# EAGLE design Spannungsversorgung (EAGLE 9.3.1)
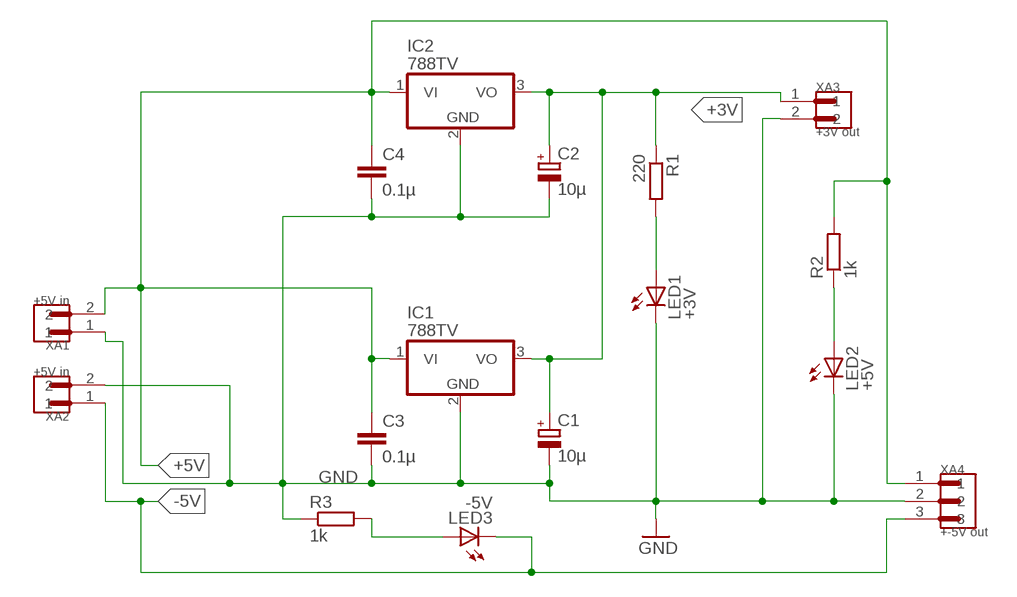
[diagram p0: schematic, sheet 1]

## Parts
C1  10µ  CPOL-EUE2.5-6  [E2,5-6]
C2  10µ  CPOL-EUE2.5-6  [E2,5-6]
C3  0.1µ  C2,5-3  [C2.5-3]
C4  0.1µ  C2,5-3  [C2.5-3]
IC1  788TV  [TO220V]
IC2  788TV  [TO220V]
LED1  +3V  TLLG4400  [LED3MM]
LED2  +5V  TLLG4400  [LED3MM]
LED3  -5V  TLLG4400  [LED3MM]
R1  220  R-EU_0207/7  [0207/7]
R2  1k  R-EU_0207/7  [0207/7]
R3  1k  R-EU_0207/7  [0207/7]
XA1  +5V in  B2P-VH(LF)(SN)  [JST_B2P-VH(LF)(SN)]
XA2  +5V in  B2P-VH(LF)(SN)  [JST_B2P-VH(LF)(SN)]
XA3  +3V out  B2P-VH(LF)(SN)  [JST_B2P-VH(LF)(SN)]
XA4  +-5V out  B3P-VH(LF)(SN)  [JST_B3P-VH(LF)(SN)]

## Nets
+3V: C1.+ C2.+ IC1.3(VO) IC2.3(VO) R1.1 XA3.1
+5V: C3.1 C4.1 IC1.1(VI) IC2.1(VI) R2.2 XA1.2 XA4.1
-5V: LED3.K(C) XA2.1 XA4.3
GND: C1.- C2.- C3.2 C4.2 IC1.2(GND) IC2.2(GND) LED1.K(C) LED2.K(C) R3.1 XA1.1 XA2.2 XA3.2 XA4.2
N$1: LED3.A R3.2
N$2: LED1.A R1.2
N$3: LED2.A R2.1

## Library data of the parts
C1 C2 = rcl:CPOL-EU: POLARIZED CAPACITOR, European symbol
C3 C4 = capacitor-wima:C: CAPACITOR naming: grid - package width
IC1 IC2 = linear:78*: Positive VOLTAGE REGULATOR Source: http://cache.national.com/ds/LM/LM78L05.pdf http://www.fairchildsemi.com/ds/LM/LM7805.pdf
LED1-LED3 = led:TLLG4400: Low Current (2mA) LED 3 mm Tinted Diffused Package color GREEN Source: Data sheet <http://www.farnell.com/datasheets/391098.pdf>; MF: VISHAY SEMICONDUCTOR; OC_FARNELL: 1612435
R1-R3 = resistor:R-EU_: RESISTOR, European symbol
XA1-XA3 = B2P-VH_LF__SN_:B2P-VH(LF)(SN): VH Series 3.96 mm Pitch, Compact, Lock Mechanism also Prevents Misinsertion; AVAILABILITY: Good; DESCRIPTION: VH Series 3.96 mm Pitch, Compact, Lock Mechanism also Prevents Misinsertion; MF: JST; MP: B2P-VH_LF__SN_; PACKAGE: FakePackage u; PRICE: 0.11 USD
XA4 = B3P-VH_LF__SN_:B3P-VH(LF)(SN): VH Series 3 Position 3.96 mm Pitch Through Hole Crimp Locking Header; AVAILABILITY: Good; DESCRIPTION: VH Series 3 Position 3.96 mm Pitch Through Hole Crimp Locking Header; MF: JST; MP: B3P-VH_LF__SN_; PACKAGE: FakePackage u; PRICE: 0.12 USD

## Net classes
0 default: clearance 0.205 mm

## Board
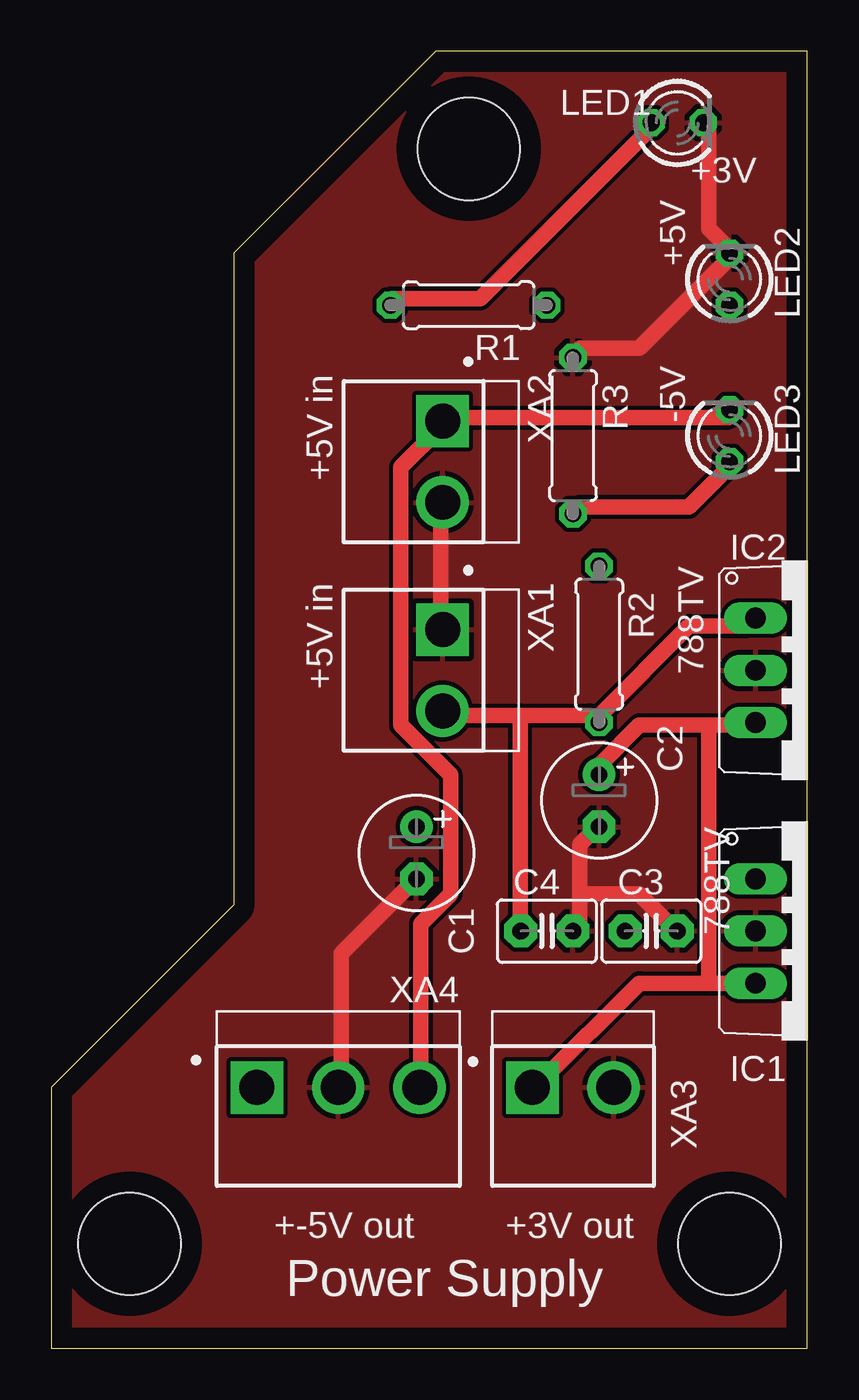
[diagram p1: board, top side]
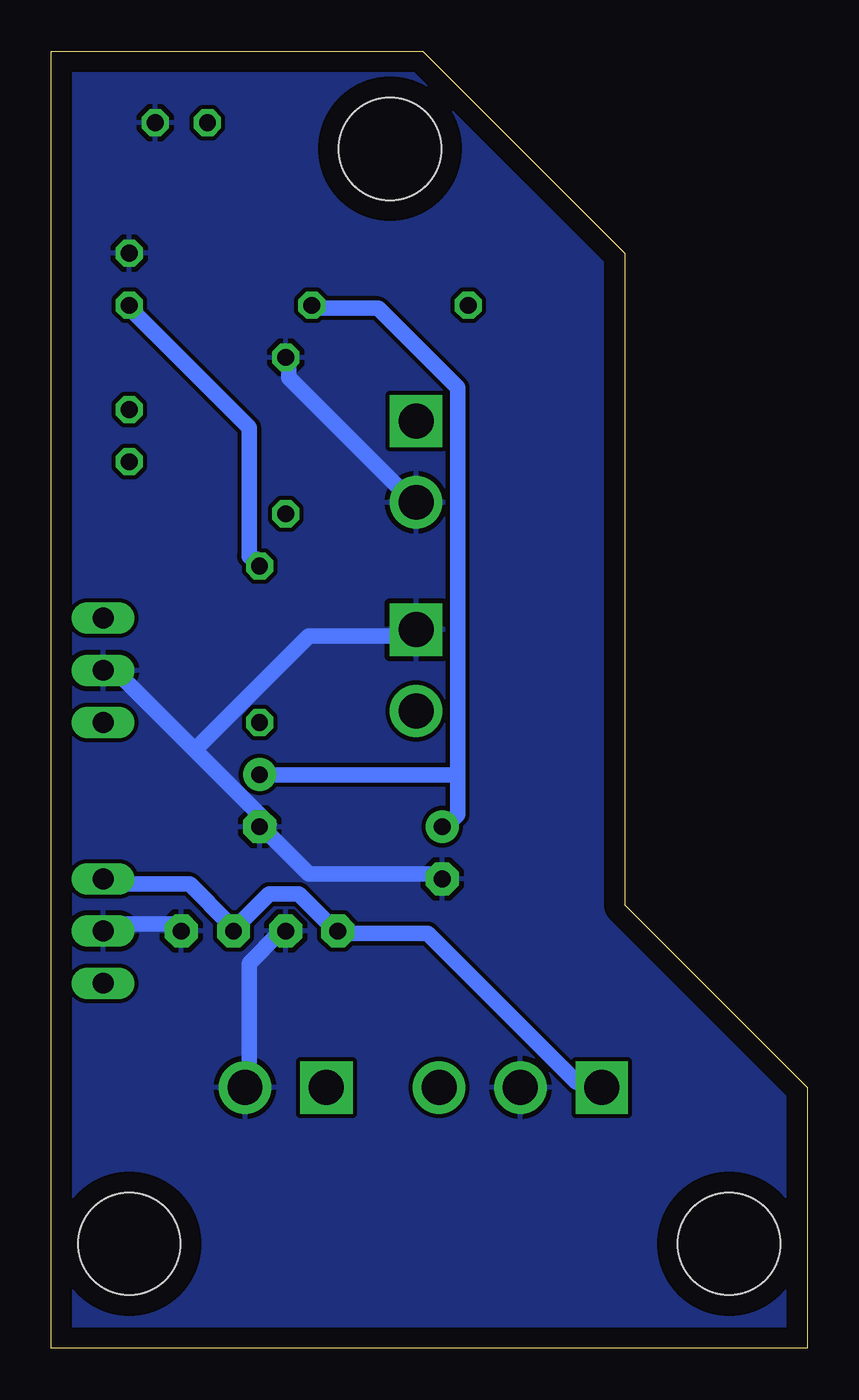
[diagram p2: board, bottom side, seen from below]

Size 36.81 x 63.17 mm. Coordinates in mm from the lower left corner, seen from the top.
Outline: 36.81,0 36.81,63.17 18.72,63.17 8.89,53.34 8.89,21.59 0,12.7 0,0 36.81,0
Copper layers (1*16): Top 0.035mm / dielectric 1.5mm / Bottom 0.035mm
Design rules "default *": minimum track width 30mil, minimum drill 0.35mm, track to track 6mil, track to pad 6mil, pad to pad 6mil, via to via 6mil, smd to smd 6mil, copper to edge 40mil, drill to drill 6mil, minimum pad ring 10mil, minimum via ring 8mil, stop-mask expansion 4mil, vias tented up to drill 0mil, thermal gap 10mil
Holes 4.98 mm at 20.32,58.42 3.81,5.08 33.02,5.08

### Footprints (pad centres in the part's own frame; a part is rotated, then mirrored left to right if it is on the bottom)
E2,5-6 = drill 0.813 pad 1.6: + -1.27,0 | drill 0.813 pad 1.6 octagon: - 1.27,0
C2.5-3 = drill 0.813 pad 1.6 octagon: 1 -1.27,0; 2 1.27,0
TO220V = drill 1.016 long: 1 -2.54,-2.54; 2 0,-2.54; 3 2.54,-2.54
LED3MM = drill 0.813 octagon: A -1.27,0; K 1.27,0
0207/7 = drill 0.813 octagon: 1 -3.81,0; 2 3.81,0
JST_B2P-VH(LF)(SN) = drill 1.7 square: 1 -1.98,0 | drill 1.7: 2 1.98,0
JST_B3P-VH(LF)(SN) = drill 1.7 square: 1 -3.96,0 | drill 1.7: 2 0,0; 3 3.96,0

### Placement (x,y rotation side)
C1  17.78,24.13 270 top
C2  26.67,26.67 270 top
C3  29.21,20.32 0 top
C4  24.13,20.32 0 top
IC1  36.83,20.32 270 top
IC2  36.83,33.02 270 top
LED1  30.48,59.69 0 top
LED2  33.02,52.07 90 top
LED3  33.02,44.45 90 top
R1  20.32,50.8 180 top
R2  26.67,34.29 270 top
R3  25.4,44.45 270 top
XA1  19.05,33.02 270 top
XA2  19.05,43.18 270 top
XA3  25.4,12.7 0 top
XA4  13.97,12.7 0 top

### Tracks (layer width: path | path; a pad name or v marks a point on that pad's centre or on a via)
+3V
  Top 0.762: 32.01,17.77 28.63,17.77 23.79,12.94 XA3.1 | 32.01,17.77 33.95,17.77 IC1.3 | 32.01,30.34 28.63,30.34 26.69,28.41 C2.+ | 32.01,30.34 33.95,30.34 IC2.3 | 32.01,30.34 32.01,17.77
  Bottom 0.762: 17.03,27.93 17.03,25.99 17.51,25.51 C1.+ | 17.03,27.93 17.03,46.78 20.89,50.65 23.79,50.65 R1.1 | 17.03,27.93 26.21,27.93 C2.+
+5V
  Top 0.762: 22.83,30.83 19.44,30.83 XA1.2 | 22.83,30.83 26.21,30.83 R2.2 26.69,30.83 31.05,35.18 33.95,35.18 IC2.1 | 22.83,30.83 22.83,20.68 C4.1
  Bottom 0.762: IC1.1 33.95,22.61 30.08,22.61 28.15,20.68 C3.1 27.66,20.68 26.21,22.12 24.76,22.12 23.31,20.68 C4.1 22.83,20.19 18.48,20.19 11.22,12.94 10.26,12.94 XA4.1
-5V
  Top 0.762: LED3.K 32.98,45.33 19.44,45.33 XA2.1 18.96,44.85 17.03,42.91 17.03,30.34 19.44,27.93 19.44,22.12 17.99,20.68 17.99,12.94 XA4.3
GND
  Top 0.762: XA1.1 18.96,35.18 18.96,40.98 XA2.2 | R3.1 25.73,48.72 28.63,48.72 32.98,53.07 LED2.K 32.98,53.55 32.01,54.52 32.01,59.35 LED1.K | 25.73,22.12 25.73,24.54 26.21,25.03 C2.- | 25.73,22.12 25.73,20.68 C4.2 | 25.73,22.12 28.63,22.12 30.08,20.68 C3.2 | XA4.2 14.12,12.94 14.12,19.22 17.51,22.61 C1.-
  Bottom 0.762: XA2.2 19.44,41.46 25.25,47.27 25.25,48.23 R3.1 | IC1.2 33.95,20.68 30.56,20.68 C3.2 | 29.84,29.14 26.21,25.51 C2.- 26.21,25.03 24.28,23.09 17.99,23.09 C1.- | 29.84,29.14 33.46,32.76 33.95,32.76 IC2.2 | XA3.2 27.18,12.94 27.18,18.74 25.73,20.19 C4.2 | 29.84,29.14 24.28,34.7 19.44,34.7 XA1.1
  pour Top: 19.05,63.5 36.83,63.5 36.83,0 0,0 0,12.7 8.89,21.59 8.89,53.34
  pour Bottom: 19.05,63.5 36.83,63.5 36.83,0 0,0 0,12.7 8.89,21.59 8.89,53.34
N$1
  Top 0.762: R3.2 25.73,40.98 31.05,40.98 32.98,42.91 LED3.A
N$2
  Top 0.762: R1.2 16.54,51.13 20.89,51.13 29.11,59.35 LED1.A
N$3
  Bottom 0.762: R2.1 26.87,38.46 27.18,38.56 27.18,44.85 32.98,50.65 LED2.A

### Text on the board
tNames: Power Supply